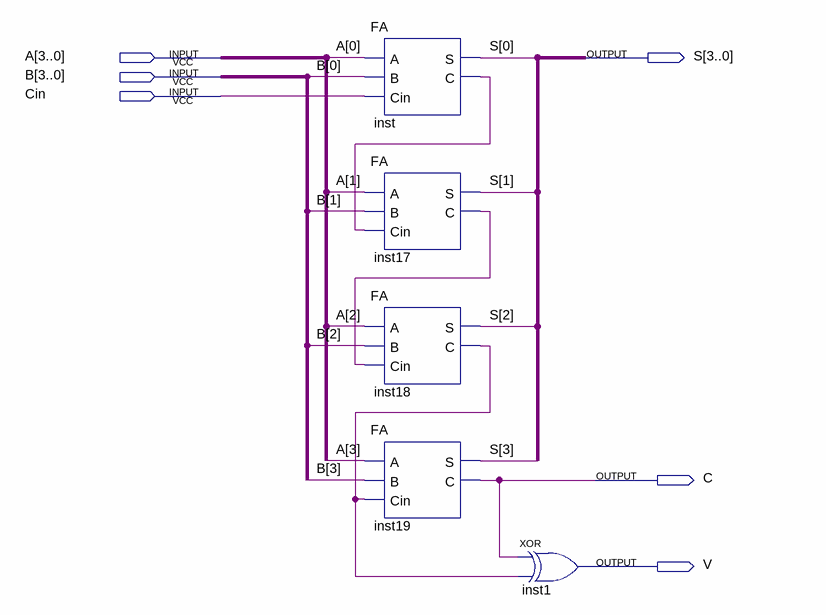
[diagram p0: schematic sheet]
// Quartus schematic Adder4S.bdf as structural Verilog: 5 symbols, 6 pins
module Adder4S (
  input  [3:0] A,
  input  [3:0] B,
  input  Cin,
  output [3:0] S,
  output C,
  output V
);

  wire inst17_c, inst18_c, inst_c;

  FA inst (.A(A[0]), .B(B[0]), .Cin(Cin), .S(S[0]), .C(inst_c));
  FA inst17 (.A(A[1]), .B(B[1]), .Cin(inst_c), .S(S[1]), .C(inst17_c));
  FA inst18 (.A(A[2]), .B(B[2]), .Cin(inst17_c), .S(S[2]), .C(inst18_c));
  FA inst19 (.A(A[3]), .B(B[3]), .Cin(inst18_c), .S(S[3]), .C(C));
  xor inst1 (V, C, inst18_c);
endmodule
